# Altium schematic sheet 11.WIFI_L-NLODB37.SchDoc
size A4; CheckedBy: YPC; DocumentNumber: 11; Revision: V1.00; SheetNumber: 11; SheetTotal: 18; SheetName: WIFI_L-NLEDB37-G5NN4; SheetDescribe: SheetDescribe; Designer: JOW; DesignDate: 2025-04-25; CheckedData: 2025-04-25; Rule: PcbType=ProtelPcb
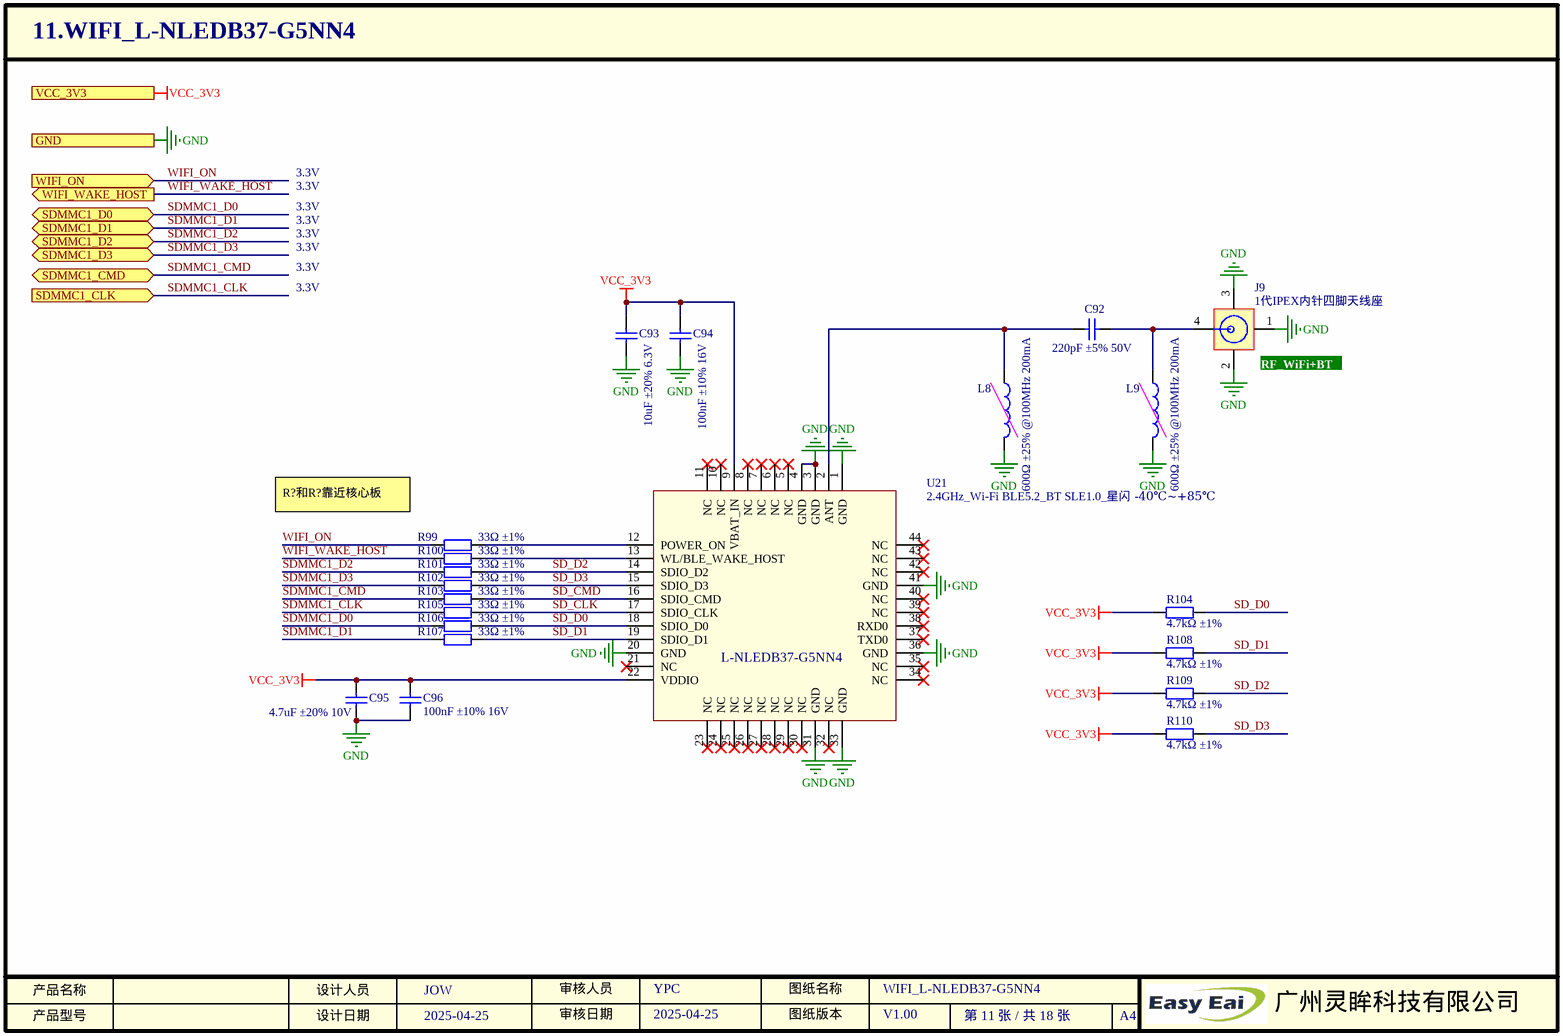
[diagram p0: 11.WIFI_L-NLODB37.SchDoc]

## Parts
C92  描述: 220pF ±5% 50V  [0402_C]  (hidden comment: GCM1555G1H221JA16D)
C93  描述: 10uF ±20% 6.3V  [0402_C]  (hidden comment: CL05A106MQ5NUNC)
C94  描述: 100nF ±10% 16V  [0402_C]  (hidden comment: CL05B104KO5NNNC)
C95  描述: 4.7uF ±20% 10V  [0402_C]  (hidden comment: CL05A475MP5NRNC)
C96  描述: 100nF ±10% 16V  [0402_C]  (hidden comment: CL05B104KO5NNNC)
J9  KH-IPEX-K501-29  [ANT-SMD_KH-IPEX-K501-29]  (value not drawn)
L8  CBW100505U601T  [0402_R]  (value not drawn)  (no BOM)
L9  CBW100505U601T  [0402_R]  (value not drawn)  (no BOM)
R99  描述: 33Ω ±1%  [0402_R]  (hidden comment: RC-02W33R0FT)
R100  描述: 33Ω ±1%  [0402_R]  (hidden comment: RC-02W33R0FT)
R101  描述: 33Ω ±1%  [0402_R]  (hidden comment: RC-02W33R0FT)
R102  描述: 33Ω ±1%  [0402_R]  (hidden comment: RC-02W33R0FT)
R103  描述: 33Ω ±1%  [0402_R]  (hidden comment: RC-02W33R0FT)
R104  描述: 4.7kΩ ±1%  [0402_R]  (hidden comment: 0402WGF4701TCE)
R105  描述: 33Ω ±1%  [0402_R]  (hidden comment: RC-02W33R0FT)
R106  描述: 33Ω ±1%  [0402_R]  (hidden comment: RC-02W33R0FT)
R107  描述: 33Ω ±1%  [0402_R]  (hidden comment: RC-02W33R0FT)
R108  描述: 4.7kΩ ±1%  [0402_R]  (hidden comment: 0402WGF4701TCE)
R109  描述: 4.7kΩ ±1%  [0402_R]  (hidden comment: 0402WGF4701TCE)
R110  描述: 4.7kΩ ±1%  [0402_R]  (hidden comment: 0402WGF4701TCE)
U21  描述: 2.4GHz_Wi-Fi BLE5.2_BT SLE1.0_星闪 -40℃~+85℃  [L-NLEDB37-G5NN4_SMT]  (hidden comment: L-NLEDB37-G5NN4)

## Ports
GND, SDMMC1_CLK (in), SDMMC1_CMD (bidir), SDMMC1_D0 (bidir), SDMMC1_D1 (bidir), SDMMC1_D2 (bidir), SDMMC1_D3 (bidir), VCC_3V3 (in), WIFI_ON (in), WIFI_WAKE_HOST (out)

## Nets
GND: C93.1 C94.1 C95.1 C96.1 J9.1 J9.2 J9.3 L8.2 L9.2 U21.1(GND) U21.3(GND) U21.4(GND) U21.20(GND) U21.31(GND) U21.33(GND) U21.36(GND) U21.41(GND) ; port GND
VCC_3V3: C93.2 C94.2 C95.2 C96.2 R104.1 R108.1 R109.1 R110.1 U21.9(VBAT_IN) U21.22(VDDIO) ; port VCC_3V3
SD_CLK: R105.2 U21.17(SDIO_CLK)
SD_CMD: R103.2 U21.16(SDIO_CMD)
SD_D0: R104.2 R106.2 U21.18(SDIO_D0)
SD_D1: R107.2 R108.2 U21.19(SDIO_D1)
SD_D2: R101.2 R109.2 U21.14(SDIO_D2)
SD_D3: R102.2 R110.2 U21.15(SDIO_D3)
SDMMC1_CLK: R105.1 ; port SDMMC1_CLK
SDMMC1_CMD: R103.1 ; port SDMMC1_CMD
SDMMC1_D0: R106.1 ; port SDMMC1_D0
SDMMC1_D1: R107.1 ; port SDMMC1_D1
SDMMC1_D2: R101.1 ; port SDMMC1_D2
SDMMC1_D3: R102.1 ; port SDMMC1_D3
WIFI_ON: R99.1 ; port WIFI_ON
WIFI_WAKE_HOST: R100.1 ; port WIFI_WAKE_HOST
NetC92_1: C92.1 L8.1 U21.2(ANT)
NetC92_2: C92.2 J9.4 L9.1
NetR99_2: R99.2 U21.12(POWER_ON)
NetR100_2: R100.2 U21.13(WL/BLE_WAKE_HOST)

Not connected (* = marked no-connect by the designer): U21 5(NC)* 6(NC)* 7(NC)* 8(NC)* 10(NC)* 11(NC)* 21(NC)* 23(NC)* 24(NC)* 25(NC)* 26(NC)* 27(NC)* 28(NC)* 29(NC)* 30(NC)* 32(NC)* 34(NC)* 35(NC)* 37(TXD0)* 38(RXD0)* 39(NC)* 40(NC)* 42(NC)* 43(NC)* 44(NC)*

## Notes on the sheet
- 3.3V
- (near J9) RF_WiFi+BT
- R?和R?靠近核心板
- 产品名称
- 产品型号
- 设计人员
- 设计日期
- 审核人员
- 审核日期
- 图纸版本
- 图纸名称
- A4
- 广州灵眸科技有限公司

## Library data of the parts
C92 = 0402 220pF ±5% 50V: SPZL000318; 名称: 贴片电容; 厂商: muRata(村田); 封装: 0402; 工作温度: -55~150℃; 贴片和直插: SMD; 型号: GCM1555G1H221JA16D; SuppliersPartNumber: C1517776; 商品编号: SPZL000318
C93 = 0402 10uF ±20% 6.3V: SPZL000269; 名称: 贴片电容; 厂商: SAMSUNG(三星); 封装: 0402; 工作温度: -55~85℃; 贴片和直插: SMD; 型号: CL05A106MQ5NUNC; SuppliersPartNumber: C15525; 商品编号: SPZL000269
C94 C96 = 0402 100nF ±10% 16V: SPZL000259; 名称: 贴片电容; 厂商: SAMSUNG(三星); 封装: 0402; 工作温度: -55~125℃; 贴片和直插: SMD; 型号: CL05B104KO5NNNC; SuppliersPartNumber: C1525; 商品编号: SPZL000259
C95 = 0402 4.7uF ±20% 10V: SPZL000339; 名称: 贴片电容; 厂商: SAMSUNG(三星); 封装: 0402; 工作温度: -55~85℃; 贴片和直插: SMD; 型号: CL05A475MP5NRNC; SuppliersPartNumber: C23733; 商品编号: SPZL000339
J9 = 1代IPEX内针四脚天线座: SPZL001156; 名称: RF连接器; 贴片和直插: SMD; 厂商: kinghelm(金航标); 封装: SMD; SuppliersPartNumber: C411563; 型号: KH-IPEX-K501-29; 商品编号: SPZL001156; 工作温度: *; 描述: 1代IPEX内针四脚天线座
L8 L9 = 600Ω ±25% @100MHz 200mA: SPZL000058; 名称: 磁珠; 封装: 0402; 厂商: FH(风华); 贴片和直插: SMD; 工作温度: -40~85℃; SuppliersPartNumber: C124083; 型号: CBW100505U601T; 商品编号: SPZL000058; 描述: 600Ω ±25% @100MHz 200mA
R99-R103 R105-R107 = 0402 33Ω ±1%: SPZL000302; 封装: 0402; 厂商: FH(风华); 贴片和直插: SMD; 名称: 电阻; 工作温度: -55~155℃; SuppliersPartNumber: C140161; 型号: RC-02W33R0FT; 商品编号: SPZL000302
R104 R108-R110 = 0402 4.7kΩ ±1%: SPZL000280; 封装: 0402; 厂商: UNI-ROYAL(厚声); 贴片和直插: SMD; 名称: 电阻; 工作温度: -55~155℃; SuppliersPartNumber: C25900; 型号: 0402WGF4701TCE; 商品编号: SPZL000280
U21 = L-NLEDB37-G5NN4: SPZL001091; 名称: IC; 封装: QFN-44(12x12); 贴片和直插: SMD; 厂商: 利尔达; 工作温度: -40℃~+85℃; 型号: L-NLEDB37-G5NN4; 商品编号: SPZL001091